# Altium schematic sheet myPLC.SchDoc
size A4
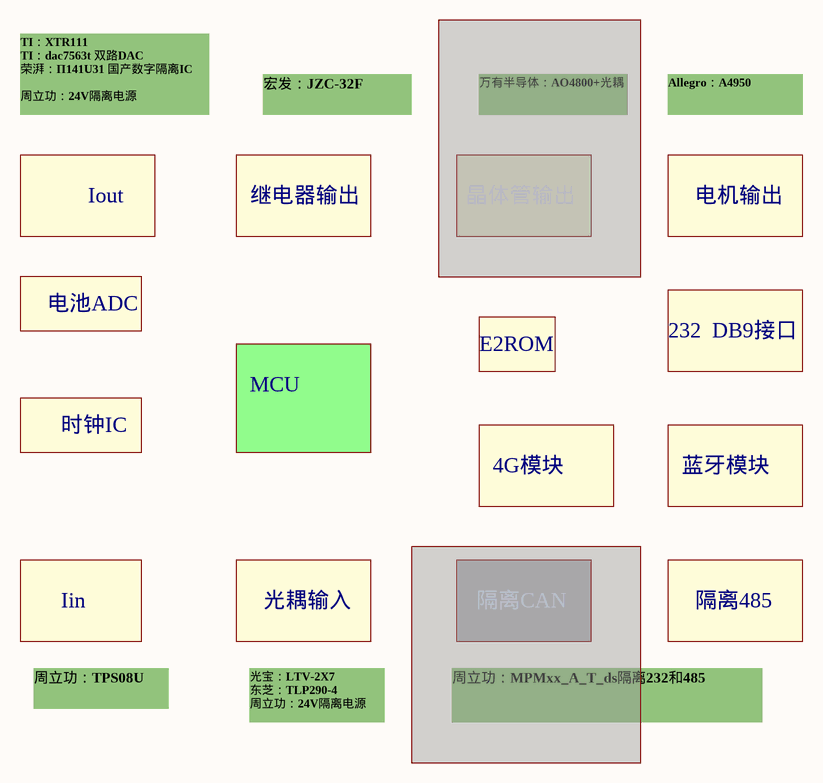
[diagram p0: myPLC.SchDoc]

## Notes on the sheet
- TI：XTR111
  TI：dac7563t 双路DAC
  荣湃：Π141U31 国产数字隔离IC
  周立功：24V隔离电源
- 宏发：JZC-32F
- 万有半导体：AO4800+光耦
- Allegro：A4950
- Iout
- 继电器输出
- 晶体管输出
- 电机输出
- 电池ADC
- MCU
- E2ROM
- 232  DB9接口
- 时钟IC
- 4G模块
- 蓝牙模块
- Iin
- 光耦输入
- 隔离CAN
- 隔离485
- 周立功：TPS08U
- 光宝：LTV-2X7
  东芝：TLP290-4
  周立功：24V隔离电源
- 周立功：MPMxx_A_T_ds隔离232和485